# EasyEDA Pro project EasyEDA.epro

# Schematic Schematic1
Board Name: Board1; Create Date: 2025-07-21; Page Name: P1; Project Name: FM_Transmitter_V2; Schematic Name: Schematic1; Update Date: 2025-07-22; Company: EasyEDA.com; Page Size: A4; Version: V1.0
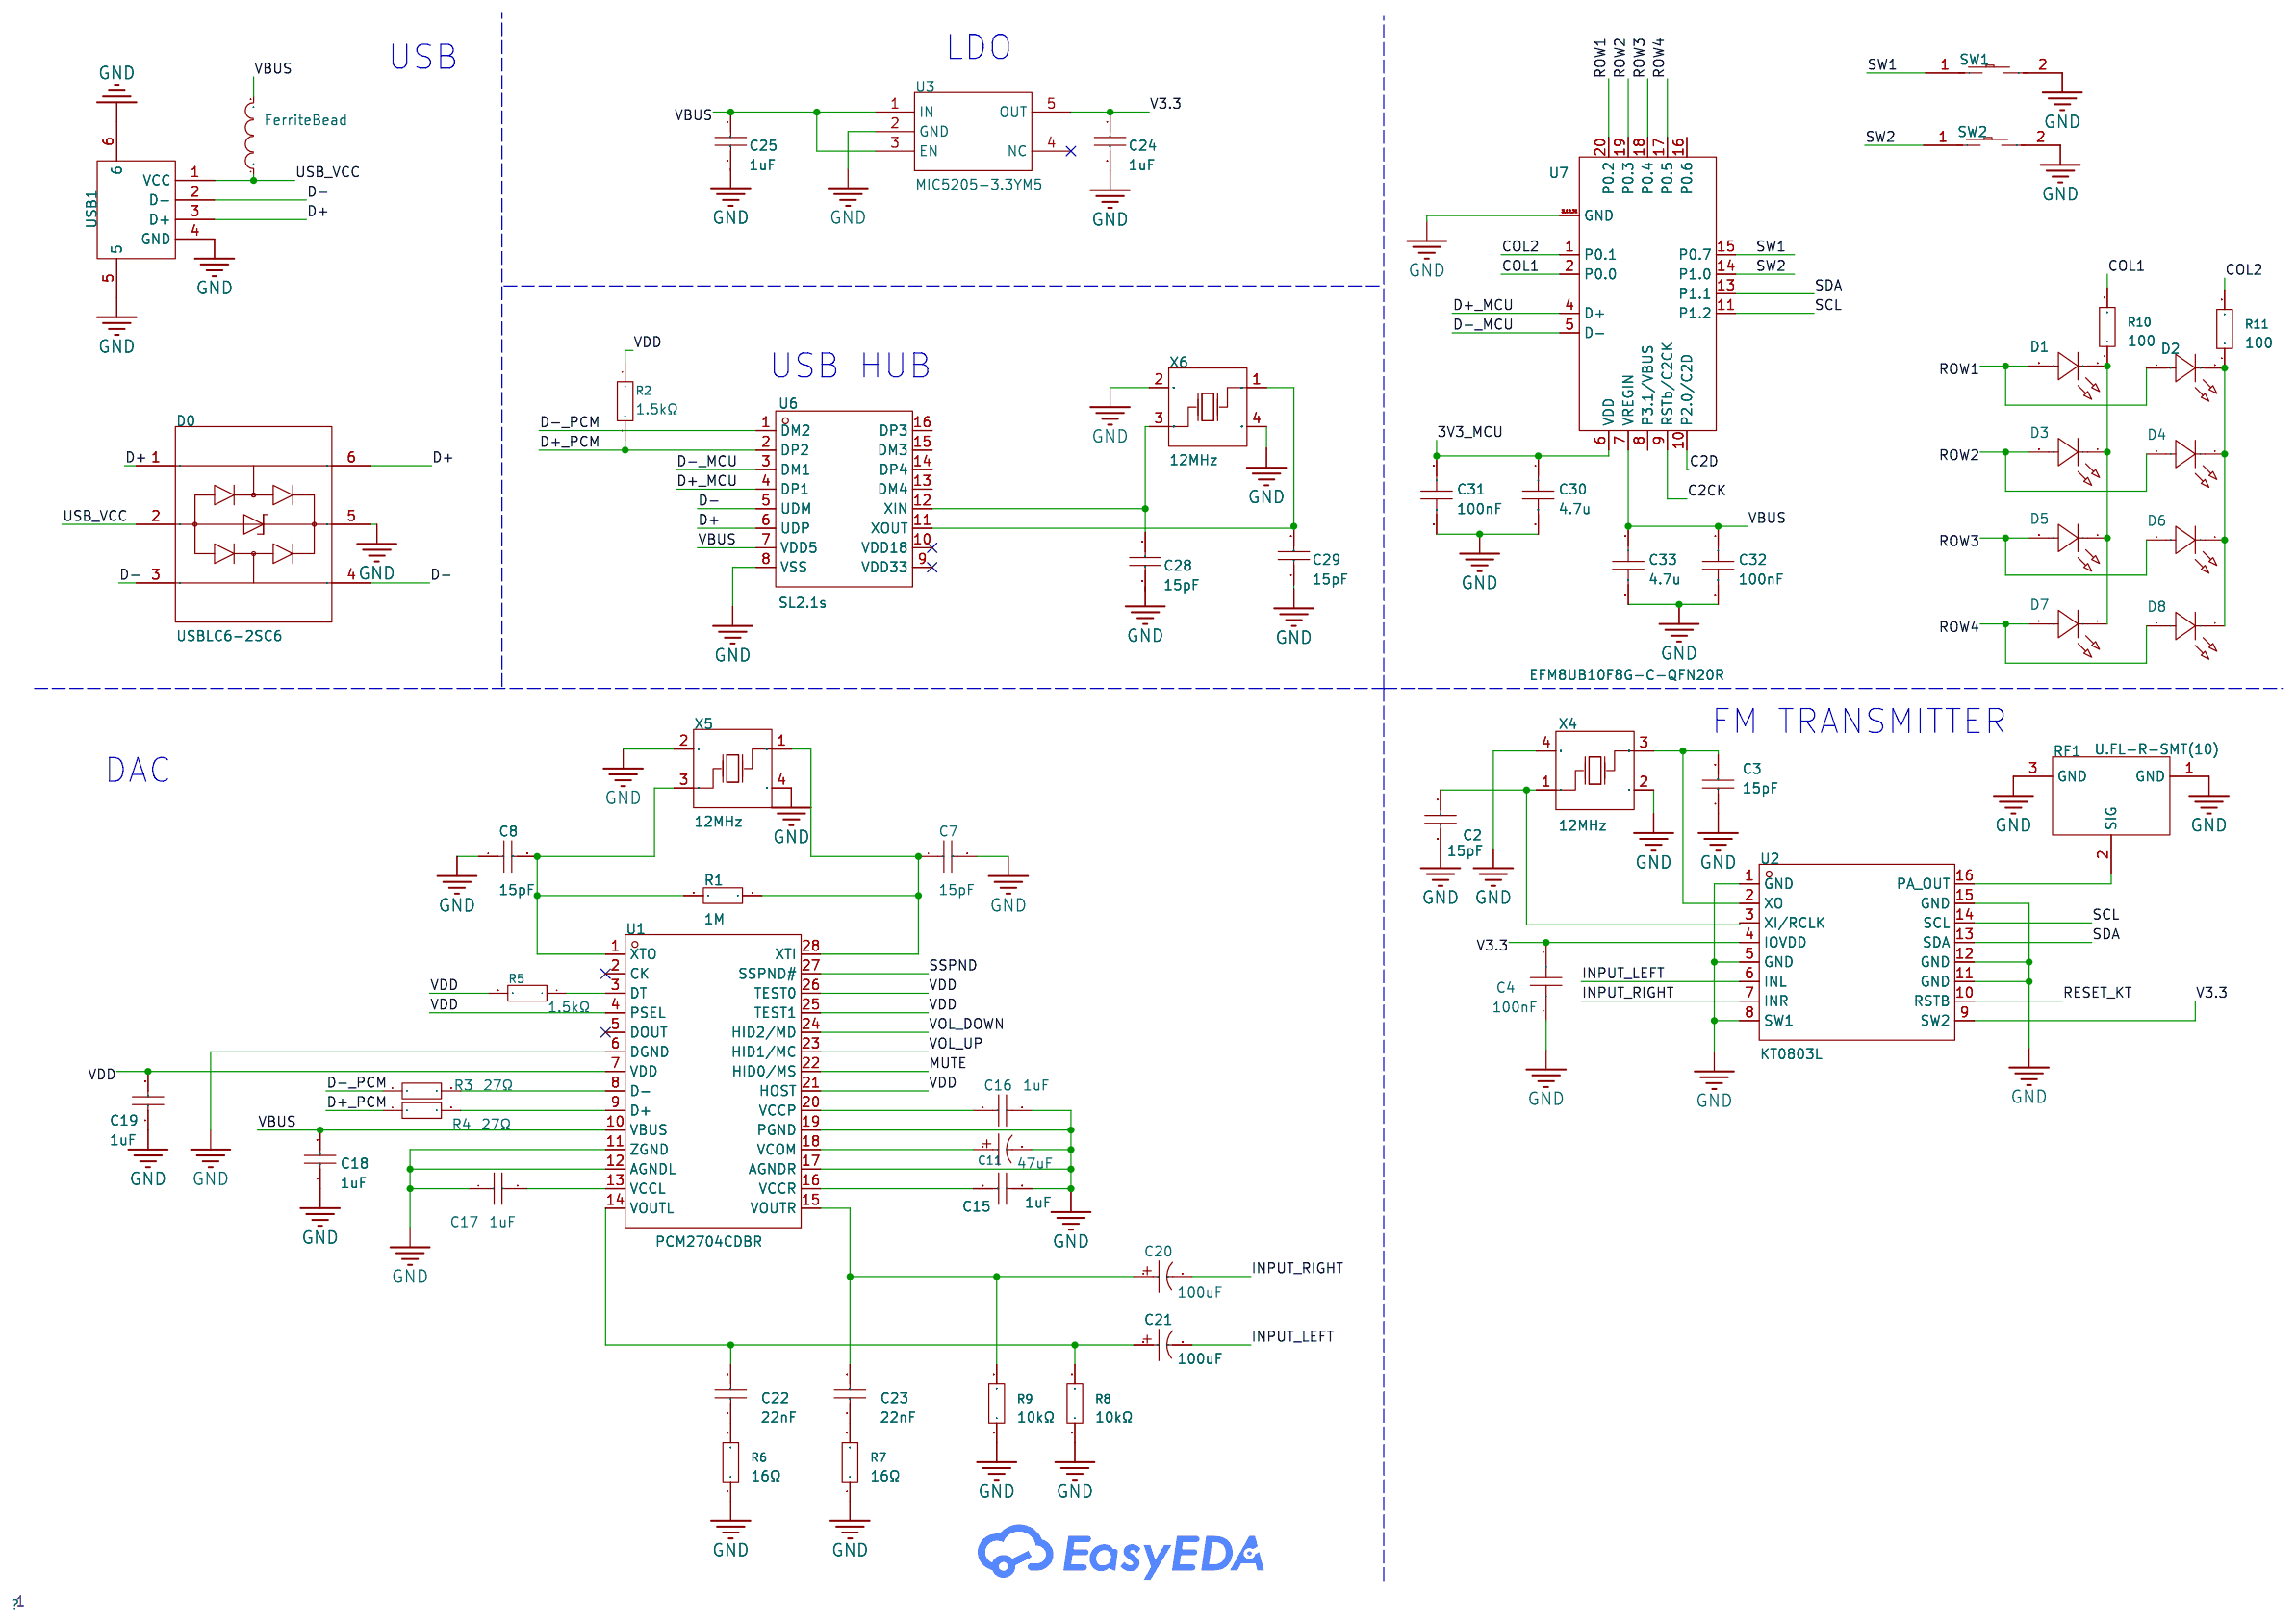
[diagram p0: schematic sheet]

## Parts
C2  15pF  [C0402]
C3  15pF  [C0402]
C4  100nF  [C0402]
C7  15pF  [C0402]
C8  15pF  [C0402]
C11  47uF  [CAP-SMD_BD5.0-L5.3-W5.3-FD]
C15  1uF  [C0402]
C16  1uF  [C0402]
C17  1uF  [C0402]
C18  1uF  [C0402]
C19  1uF  [C0402]
C20  100uF  [CAP-SMD_BD5.0-L5.3-W5.3-FD]
C21  100uF  [CAP-SMD_BD5.0-L5.3-W5.3-FD]
C22  22nF  [C0402]
C23  22nF  [C0402]
C24  1uF  [C0402]
C25  1uF  [C0402]
C28  15pF  [C0402]
C29  15pF  [C0402]
C30  4.7u  [C0402]
C31  100nF  [C0402]
C32  100nF  [C0402]
C33  4.7u  [C0402]
D0  USBLC6-2SC6  [SOT-23-6_L2.9-W1.6-P0.95-LS2.8-BL]
D1  XL-1005UGC  [LED0402-RD_GREEN]
D2  XL-1005UGC  [LED0402-RD_GREEN]
D3  XL-1005UGC  [LED0402-RD_GREEN]
D4  XL-1005UGC  [LED0402-RD_GREEN]
D5  XL-1005UGC  [LED0402-RD_GREEN]
D6  XL-1005UGC  [LED0402-RD_GREEN]
D7  XL-1005UGC  [LED0402-RD_GREEN]
D8  XL-1005UGC  [LED0402-RD_GREEN]
FerriteBead  MPZ1608S101ATAH0  [L0805]
R1  1M  [R0402]
R2  1.5kΩ  [R0402]
R3  27Ω  [R0402]
R4  27Ω  [R0402]
R5  1.5kΩ  [R0402]
R6  16Ω  [R0402]
R7  16Ω  [R0402]
R8  10kΩ  [R0402]
R9  10kΩ  [R0402]
R10  100  [R0402]
R11  100  [R0402]
RF1  U.FL-R-SMT(10)  [ANT-SMD_UFL-R-SMT01]
SW1  B3U-1000P  [KEY-SMD_B3U-1000PM]
SW2  B3U-1000P  [KEY-SMD_B3U-1000PM]
U1  PCM2704CDBR  [SSOP-28_L10.2-W5.3-P0.65-LS7.8-BL]
U2  KT0803L  [SOP-16_L9.9-W3.9-P1.27-LS6.0-BL]
U3  MIC5205-3.3YM5  [SOT-23-5_L2.9-W1.6-P0.95-LS2.8-BR]
U6  SL2.1s  [SSOP-16_L4.6-W2.6-P0.53-LS4.0-BL]
U7  EFM8UB10F8G-C-QFN20R  [QFN-20_L3.0-W3.0-P0.50-TL-EP1.7_SILICON_C8051F85X]
USB1  U-G-O4DD-W-1  [USB-A-TH_U-G-04WD-W-01]
X4  12MHz  [CRYSTAL-SMD_4P-L2.5-W2.0-BL-A]
X5  12MHz  [CRYSTAL-SMD_4P-L2.5-W2.0-BL-A]
X6  12MHz  [CRYSTAL-SMD_4P-L2.5-W2.0-BL-A]

## Library data of the parts
C2 C3 C7 C8 C28 C29 = 0402CG150J500NT: Capacitance: Tolerance:±5% Tolerance:±5% Voltage Rated: Temperature Coefficient:; LCSC Part Name: 15pF ±5% 50V; Supplier Part: C1548; Manufacturer: FH(风华); Supplier Footprint: 0402; JLCPCB Part Class: Basic Part; Datasheet: https://atta.szlcsc.com/upload/public/pdf/source/20200305/C486355_26A10D38EF8C2A5C37091D0039909270.pdf; Supplier: LCSC; Tolerance: ±5%
C4 = CL05B104KO5NNNC: Capacitance: Tolerance:±10% Tolerance:±10% Voltage Rated: Temperature Coefficient:; LCSC Part Name: 100nF ±10% 16V; Supplier Part: C1525; Manufacturer: SAMSUNG(三星); Supplier Footprint: 0402; JLCPCB Part Class: Basic Part; Datasheet: https://atta.szlcsc.com/upload/public/pdf/source/20160218/1457707763339.pdf; Supplier: LCSC; Tolerance: ±10%
C11 = RVT1C470M0505: Capacitance: Tolerance:±20% Tolerance:±20% Rated Voltage: Ripple Current:- Equivalent Series Resistance(ESR):- φD: L: Lifetime @ Temp:2000hrs@105℃ Operating Temperature:-55℃~+105℃ Operating Temperature:-55℃~+105℃; LCSC Part Name: 47uF ±20% 16V; Supplier Part: C3337; Manufacturer: HONOR(荣誉); Supplier Footprint: SMD,D5xL5.4mm; JLCPCB Part Class: Extended Part; Datasheet: https://atta.szlcsc.com/upload/public/pdf/source/20170602/1496384426683.pdf; Supplier: LCSC; Tolerance: ±20%; Lifetime @ Temp: 2000hrs@105℃; Operating Temperature: -55℃~+105℃
C15-C19 C24 C25 = CL10A105KO8NNNC: Capacitance: Tolerance:±10% Tolerance:±10% Voltage Rated: Temperature Coefficient:; LCSC Part Name: 1uF ±10% 16V; Supplier Part: C1592; Manufacturer: SAMSUNG(三星); Supplier Footprint: 0603; JLCPCB Part Class: Extended Part; Datasheet: https://atta.szlcsc.com/upload/public/pdf/source/20220919/9FBE606BE0D9532D730F292EB26DC5BB.pdf; Supplier: LCSC; Tolerance: ±10%
C20 C21 = RVT1E101M0607: Capacitance:100uF Tolerance:±20% Tolerance:±20% Voltage Rating:25V Ripple Current:- Equivalent Series Resistance(ESR):- Diameter:6.3mm Height - Seated (Max):7.7mm Lifetime:2000hrs@105℃ Operating Temperature:-55℃~+105℃ Operating Temperature:-55℃~+105℃; LCSC Part Name: 100uF ±20% 25V; Supplier Part: C3338; Manufacturer: HONOR(荣誉); Supplier Footprint: SMD,D6.3xL7.7mm; JLCPCB Part Class: Extended Part; Datasheet: https://atta.szlcsc.com/upload/public/pdf/source/20250304/8AEF5A10740A8CC68A04B0B0B1D3A755.pdf; Supplier: LCSC; Tolerance: ±20%; Voltage Rating: 25V; Diameter: 6.3mm; Height - Seated (Max): 7.7mm; Lifetime: 2000hrs@105℃; Operating Temperature: -55℃~+105℃
C22 C23 = 0402B223K500NT: Capacitance:22nF Tolerance:±10% Tolerance:±10% Voltage Rating:50V Temperature Coefficient:X7R; LCSC Part Name: 22nF ±10% 50V; Supplier Part: C1532; Manufacturer: FH(风华); Supplier Footprint: 0402; Datasheet: https://atta.szlcsc.com/upload/public/pdf/source/20200305/C486355_26A10D38EF8C2A5C37091D0039909270.pdf; Supplier: LCSC; Tolerance: ±10%; Voltage Rating: 50V; Temperature Coefficient: X7R
C30-C33 = CAP_0402: Supplier Part: C1525; Supplier Footprint: 0402
D0 = USBLC6-2SC6: Reverse Stand-Off Voltage (Vrwm):5V Maximum Clamping Voltage:20V Peak Pulse Current (Ipp)@10/1000us:5A Breakdown Voltage:6V Type:ESD; LCSC Part Name: ESD二极管 USBLC6-2SC6; Supplier Part: C323793; Supplier Footprint: SOT-23-6; JLCPCB Part Class: Extended Part; Datasheet: https://atta.szlcsc.com/upload/public/pdf/source/20181029/C323793_48F7908330A3F84485333C8DC43F9E49.pdf; Supplier: LCSC; Reverse Stand-Off Voltage (Vrwm): 5V; Maximum Clamping Voltage: 20V; Peak Pulse Current (Ipp)@10/1000us: 5A; Breakdown Voltage: 6V; Type: ESD
D1-D8 = XL-1005UGC_C965793: Emitted Color:Emerald Forward Voltage (VF):3V Forward Voltage (VF):3V Power Dissipation:80mW Forward Current:25mA Dominant Wavelength:516nm~531nm Dominant Wavelength:516nm~531nm Peak Wavelength:531nm Lens Color:Colorless Transparent Lens Color Temperature; Supplier Part: C965793; Manufacturer: XINGLIGHT(成兴光); Supplier Footprint: 0402; JLCPCB Part Class: Extended Part; Datasheet: https://atta.szlcsc.com/upload/public/pdf/source/20201230/C965793_0CDDD21E721E0FD2A4CEAFDFDBC3C135.pdf; Supplier: LCSC; Emitted Color: Emerald; Forward Voltage (VF): 3V; Power Dissipation: 80mW; Forward Current: 25mA; Dominant Wavelength: 516nm~531nm; Peak Wavelength: 531nm; Lens Color: Colorless Transparent Lens; Luminous Intensity: 249mcd; Viewing Angle: 120°; Mounting Sytle: Positive Stick; Operating Temperature: -30℃~+85℃
FerriteBead = MPZ1608S101ATAH0: Impedance @ Frequency:100Ω@100MHz Tolerance:±25% Tolerance:±25% DC Resistance:30mΩ Current Rating:3A Circuits:1; LCSC Part Name: 单路 0603磁珠 阻抗100Ω@100MHz; Supplier Part: C107332; Manufacturer: TDK; Supplier Footprint: 0603; JLCPCB Part Class: Extended Part; Datasheet: https://atta.szlcsc.com/upload/public/pdf/source/20170420/1492670791787.pdf; Supplier: LCSC; Impedance @ Frequency: 100Ω@100MHz; Tolerance: ±25%; DC Resistance: 30mΩ; Current Rating: 3A; Circuits: 1
R1 = 1M: link: https://item.szlcsc.com/323315.html; 3DModel: R0402_L1.0-W0.5-H0.5; Supplier: LCSC; Manufacturer: UniOhm; Manufacturer Part: 0402WGF1004TCE; Supplier Part: C26083; JLCPCB Part Class: Basic
R2 R5 = 0402WGF1501TCE: Type:Thick Film Resistors Resistance:1.5kΩ Tolerance:±1% Tolerance:±1% Power(Watts): Overload Voltage (Max): Temperature Coefficient:±100ppm/℃ Temperature Coefficient:±100ppm/℃ Operating Temperature Range:-55℃~+155℃ Operating Temperature Range:-55℃~+155℃; LCSC Part Name: 1.5kΩ ±1% 62.5mW 厚膜电阻; Supplier Part: C25867; Manufacturer: UNI-ROYAL(厚声); Supplier Footprint: 0402; JLCPCB Part Class: Basic Part; Datasheet: https://atta.szlcsc.com/upload/public/pdf/source/20200306/C422600_1E6D84923E4A46A82E41ADD87F860B5C.pdf; Supplier: LCSC; Type: Thick Film Resistors; Tolerance: ±1%; Temperature Coefficient: ±100ppm/℃; Operating Temperature Range: -55℃~+155℃
R3 R4 = 0402WGF270JTCE: Type:Thick Film Resistors Resistance:27Ω Tolerance:±1% Tolerance:±1% Power(Watts): Overload Voltage (Max): Temperature Coefficient:±100ppm/℃ Temperature Coefficient:±100ppm/℃ Operating Temperature Range:-55℃~+155℃ Operating Temperature Range:-55℃~+155℃; LCSC Part Name: 27Ω ±1% 62.5mW 厚膜电阻; Supplier Part: C25100; Manufacturer: UNI-ROYAL(厚声); Supplier Footprint: 0402; JLCPCB Part Class: Extended Part; Datasheet: https://atta.szlcsc.com/upload/public/pdf/source/20200306/C422600_1E6D84923E4A46A82E41ADD87F860B5C.pdf; Supplier: LCSC; Type: Thick Film Resistors; Tolerance: ±1%; Temperature Coefficient: ±100ppm/℃; Operating Temperature Range: -55℃~+155℃
R6 R7 = 0603WAF160JT5E: Type:Thick Film Resistors Resistance:16Ω Tolerance:±1% Tolerance:±1% Power(Watts): Overload Voltage (Max): Temperature Coefficient:±100ppm/℃ Temperature Coefficient:±100ppm/℃ Operating Temperature Range:-55℃~+155℃ Operating Temperature Range:-55℃~+155℃; LCSC Part Name: 16Ω ±1% 100mW 厚膜电阻; Supplier Part: C25185; Manufacturer: UNI-ROYAL(厚声); Supplier Footprint: 0603; JLCPCB Part Class: Extended Part; Datasheet: https://atta.szlcsc.com/upload/public/pdf/source/20200306/C422600_1E6D84923E4A46A82E41ADD87F860B5C.pdf; Supplier: LCSC; Type: Thick Film Resistors; Tolerance: ±1%; Temperature Coefficient: ±100ppm/℃; Operating Temperature Range: -55℃~+155℃
R8-R11 = 0402WGJ0103TCE: Type:Thick Film Resistors Resistance:10kΩ Tolerance:±5% Tolerance:±5% Power(Watts): Overload Voltage (Max): Temperature Coefficient:±100ppm/℃ Temperature Coefficient:±100ppm/℃ Operating Temperature Range:-55℃~+155℃ Operating Temperature Range:-55℃~+155℃; LCSC Part Name: 10kΩ ±5% 62.5mW 厚膜电阻; Supplier Part: C25531; Manufacturer: UNI-ROYAL(厚声); Supplier Footprint: 0402; JLCPCB Part Class: Extended Part; Datasheet: https://atta.szlcsc.com/upload/public/pdf/source/20200306/C422600_1E6D84923E4A46A82E41ADD87F860B5C.pdf; Supplier: LCSC; Type: Thick Film Resistors; Tolerance: ±5%; Temperature Coefficient: ±100ppm/℃; Operating Temperature Range: -55℃~+155℃
RF1 = U.FL-R-SMT(10): Connector Type:板端 Interface Type:内针 Number of Ports:1 Interface Diameter:2mm Interface Length/Height:1.25mm Frequency-Max:6GHz RF Series:IPEX Impedance:50Ω Style:- Contact Material:Brass Operating Temperature Range:-40℃~+90℃ Operating Temperature Range:-4; LCSC Part Name: IPEX 内针; Supplier Part: C434808; Manufacturer: HRS(广濑); Supplier Footprint: SMD; JLCPCB Part Class: Extended Part; Datasheet: https://atta.szlcsc.com/upload/public/pdf/source/20191010/C434816_11DAC26C7ED37A2D3E584E7DBDF6972E.pdf; Supplier: LCSC; Connector Type: 板端; Interface Type: 内针; Number of Ports: 1; Interface Diameter: 2mm; Interface Length/Height: 1.25mm; Frequency-Max: 6GHz; RF Series: IPEX; Impedance: 50Ω; Contact Material: Brass; Operating Temperature Range: -40℃~+90℃
SW1 SW2 = B3U-1000P_C231329: Circuit:SPST Actuator Style:Round Button Operating Force:153gf Mounting Style:Standing paste Switch Length:3mm Switch Width:2.5mm Switch Height:1.6mm Contact Current:50mA Voltage Rating (DC):12V With Lamp:- Pin Style:SMDSplicing Mechanical Life:- Operatin; LCSC Part Name: 3*2.5*1.6mm 立贴 轻触开关; Supplier Part: C231329; Manufacturer: OMRON(欧姆龙); Supplier Footprint: SMD,2.5x3mm; JLCPCB Part Class: Extended Part; Supplier: LCSC; Circuit: SPST; Actuator Style: Round Button; Operating Force: 153gf; Mounting Style: Standing paste; Switch Length: 3mm; Switch Width: 2.5mm; Switch Height: 1.6mm; Contact Current: 50mA; Voltage Rating (DC): 12V; Pin Style: SMDSplicing; Operating Temperature: -25℃~+70℃
U1 = PCM2704CDBR: Resolution:16 Number of Channels:- Voltage - Supply:3V~5.25V Voltage - Supply:3V~5.25V Interface Type:USB；SPI Operating Temperature:-25℃~+85℃ Operating Temperature:-25℃~+85℃; Supplier Part: C2859784; Manufacturer: TI(德州仪器); Supplier Footprint: SSOP-28-208mil; JLCPCB Part Class: Extended Part; Datasheet: https://www.ti.com/cn/lit/gpn/pcm2706c; Supplier: LCSC; Resolution: 16; Voltage - Supply: 3V~5.25V; Interface Type: USB；SPI; Operating Temperature: -25℃~+85℃
U2 = KT0803L: Supplier Part: C9900105795; Supplier Footprint: SOP16; JLCPCB Part Class: Extended Part; Supplier: LCSC
U3 = MIC5205-3.3YM5: Output Type:Fixed Voltage - Supply:20V Output Voltage:3.3V Output Voltage:3.3V Output Current:150mA Power Supply Rejection Ratio (PSRR):70dB@(1kHz) Operating Temperature:-40℃~+125℃@(Tj) Operating Temperature:-40℃~+125℃@(Tj) Output Configuration:Positive e; LCSC Part Name: 线性稳压器(LDO); Supplier Part: C20617303; Manufacturer: TECH PUBLIC(台舟); Supplier Footprint: SOT-23-5; JLCPCB Part Class: Extended Part; Datasheet: https://atta.szlcsc.com/upload/public/pdf/source/20240202/BF02EA9B20BC582DB45A13FA3EA98D4D.pdf; Supplier: LCSC; Output Type: Fixed; Voltage - Supply: 20V; Output Voltage: 3.3V; Output Current: 150mA; Power Supply Rejection Ratio (PSRR): 70dB@(1kHz); Operating Temperature: -40℃~+125℃@(Tj); Output Configuration: Positive electrode; Number of Outputs: 1
U6 = SL2.1s: Supplier Part: C2684433; Manufacturer: CoreChips(和芯润德); Supplier Footprint: SSOP-16-2.6mm; Datasheet: https://atta.szlcsc.com/upload/public/pdf/source/20210326/C2684433_0308B0C984AD3FC6CBDA43F1CDB06B3F.pdf; Supplier: LCSC
U7 = EFM8UB10F8G-C-QFN20R: CPU Core:51Series Program Storage Size:8KB RAM Size:2.25KB GPIO Ports Number:13 Operating Voltage Range:1.71V~3.6V Operating Voltage Range:1.71V~3.6V CPU Maximum Speed:50MHz Program Memory Type:FLASH Operating Temperature Range:-40℃~+85℃ Operating Tempera; Supplier Part: C2055590; Manufacturer: SKYWORKS/SILICON LABS(芯科); Supplier Footprint: QFN-20-EP(3x3); Datasheet: https://atta.szlcsc.com/upload/public/pdf/source/20210702/AAB6029825307DEA1E2C140C782B19C1.pdf; Supplier: LCSC; CPU Core: 51Series; Program Storage Size: 8KB; RAM Size: 2.25KB; GPIO Ports Number: 13; Operating Voltage Range: 1.71V~3.6V; CPU Maximum Speed: 50MHz; Program Memory Type: FLASH; Operating Temperature Range: -40℃~+85℃; ADC (Bit): 12bit; Peripheral/Function: Watchdog; Watchdog: Yes; Internal Oscillator: Yes
USB1 = U-G-O4DD-W-1: Connector Type:Type-A Standard:USB 2.0 Gender:公 Number of Ports:1 Number of Contacts:4P Current Rating - Power (Max):1A; LCSC Part Name: Type-A 公; Supplier Part: C98125; Manufacturer: 韩国韩荣; Supplier Footprint: 插件; JLCPCB Part Class: Extended Part; Datasheet: https://atta.szlcsc.com/upload/public/pdf/source/20190321/C98125_6153EFB71EE46DEADFAFF2A82C946B59.pdf; Supplier: LCSC; Connector Type: Type-A; Standard: USB 2.0; Gender: 公; Number of Ports: 1; Number of Contacts: 4P; Current Rating - Power (Max): 1A
X4-X6 = SX2B12.000F1010F30: Type:Crystal Oscillator Frequency:12MHz Normal temperature Frequency Tolerance:±10ppm Normal temperature Frequency Tolerance:±10ppm Load Capacitance:10pF Frequency Stability:±30ppm Frequency Stability:±30ppm Equivalent Series Resistance(ESR):200Ω Operatin; LCSC Part Name: 12MHz ±10ppm 10pF; Supplier Part: C7301971; Manufacturer: SCTF(星通时频); Supplier Footprint: SMD2520-4P; JLCPCB Part Class: Extended Part; Datasheet: https://atta.szlcsc.com/upload/public/pdf/source/20240418/57769B85D7CD97C84A424B0AE31F5144.pdf; Supplier: LCSC; Type: Crystal Oscillator; Normal temperature Frequency Tolerance: ±10ppm; Load Capacitance: 10pF; Frequency Stability: ±30ppm; Equivalent Series Resistance(ESR): 200Ω; Operating Temperature: -40℃~+85℃

## Nets
3V3_MCU: C30.1 C31.1 U7.6(VDD)
GND: C2.1 C3.1 C4.1 C7.2 C8.1 C11.2 C15.2 C16.2 C17.1 C18.1 C19.1 C24.2 C25.2 C28.1 C29.1 C30.2 C31.2 C32.2 C33.2 D0.5 R6.1 R7.1 R8.1 R9.1 RF1.1(GND) RF1.3(GND) SW1.2 SW2.2 U1.6(DGND) U1.11(ZGND) U1.12(AGNDL) U1.17(AGNDR) U1.19(PGND) U2.1(GND) U2.5(GND) U2.8(SW1) U2.11(GND) U2.12(GND) U2.15(GND) U3.2(GND) U6.8(VSS) U7.3,12,21(GND) USB1.4(GND) USB1.5 USB1.6 X4.2(GND) X4.4(GND) X5.2(GND) X5.4(GND) X6.2(GND) X6.4(GND)
V3.3: C4.2 C24.1 U2.4(IOVDD) U2.9(SW2) U3.5(OUT)
VBUS: C18.2 C25.1 C32.1 C33.1 FerriteBead.2 U1.10(VBUS) U3.1(IN) U3.3(EN) U6.7(VDD5) U7.7(VREGIN)
VDD: C19.2 R2.1 R5.2 U1.4(PSEL) U1.7(VDD) U1.21(HOST) U1.25(TEST1) U1.26(TEST0)
C2CK: U7.9(RSTb/C2CK)
C2D: U7.10(P2.0/C2D)
COL1: R10.2 U7.2(P0.0)
COL2: R11.2 U7.1(P0.1)
D+: D0.1 D0.6 U6.6(UDP) USB1.3(D+)
D+_MCU: U6.4(DP1) U7.4(D+)
D+_PCM: R2.2 R4.1 U6.2(DP2)
D-: D0.3 D0.4 U6.5(UDM) USB1.2(D-)
D-_MCU: U6.3(DM1) U7.5(D-)
D-_PCM: R3.1 U6.1(DM2)
INPUT_LEFT: C21.2 U2.6(INL)
INPUT_RIGHT: C20.2 U2.7(INR)
MUTE: U1.22(HID0/MS)
RESET_KT: U2.10(RSTB)
ROW1: D1.2(A) D2.2(A) U7.20(P0.2)
ROW2: D3.2(A) D4.2(A) U7.19(P0.3)
ROW3: D5.2(A) D6.2(A) U7.18(P0.4)
ROW4: D7.2(A) D8.2(A) U7.17(P0.5)
SCL: U2.14(SCL) U7.11(P1.2)
SDA: U2.13(SDA) U7.13(P1.1)
SSPND: U1.27(SSPND#)
SW1: SW1.1 U7.15(P0.7)
SW2: SW2.1 U7.14(P1.0)
USB_VCC: D0.2 FerriteBead.1 USB1.1(VCC)
VOL_DOWN: U1.24(HID2/MD)
VOL_UP: U1.23(HID1/MC)
Net-(C2-2): C2.2 U2.3(XI/RCLK) X4.1(OSC1)
Net-(C3-2): C3.2 U2.2(XO) X4.3(OSC2)
Net-(C7-1): C7.1 R1.2 U1.28(XTI) X5.1(OSC1)
Net-(C8-2): C8.2 R1.1 U1.1(XTO) X5.3(OSC2)
Net-(C11-1): C11.1 U1.18(VCOM)
Net-(C15-1): C15.1 U1.16(VCCR)
Net-(C16-1): C16.1 U1.20(VCCP)
Net-(C17-2): C17.2 U1.13(VCCL)
Net-(C20-1): C20.1 C23.2 R9.2 U1.15(VOUTR)
Net-(C21-1): C21.1 C22.2 R8.2 U1.14(VOUTL)
Net-(C22-1): C22.1 R6.2
Net-(C23-1): C23.1 R7.2
Net-(C28-2): C28.2 U6.12(XIN) X6.3(OSC2)
Net-(C29-2): C29.2 U6.11(XOUT) X6.1(OSC1)
Net-(D1-1): D1.1(K) D3.1(K) D5.1(K) D7.1(K) R10.1
Net-(D2-1): D2.1(K) D4.1(K) D6.1(K) D8.1(K) R11.1
Net-(R3-2): R3.2 U1.8(D-)
Net-(R4-2): R4.2 U1.9(D+)
Net-(R5-1): R5.1 U1.3(DT)
Net-(RF1-2): RF1.2(SIG) U2.16(PA_OUT)

Not connected (* = marked no-connect by the designer): U1 2(CK)* 5(DOUT)*; U3 4(NC)*; U6 9(VDD33)* 10(VDD18)* 13(DM4) 14(DP4) 15(DM3) 16(DP3); U7 8(P3.1/VBUS) 16(P0.6)

## Notes on the sheet
- LDO
- USB
- USB HUB
- FM TRANSMITTER
- DAC
